# Altium project IMX425LLJ_MEZ.PrjPcb
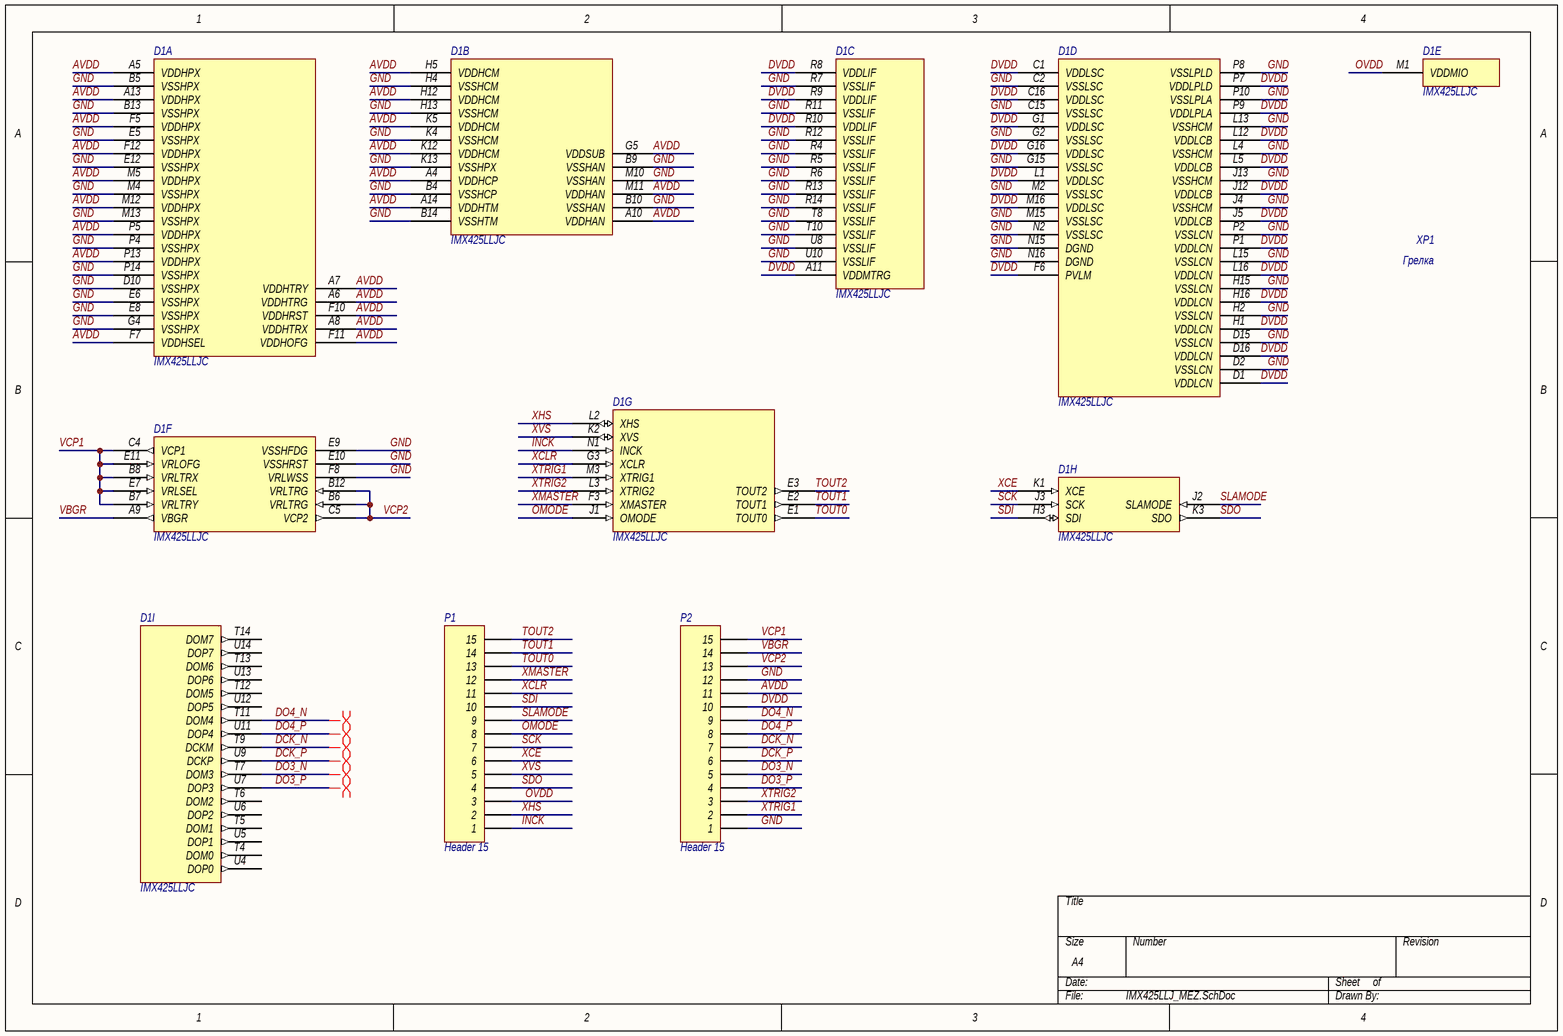
[diagram p0: IMX425LLJ_MEZ.SchDoc]
1 sheet, 4 parts. Net scope: global (net labels, ports and power ports of the same name join across sheets).
Board file: IMX425LLJ_MEZ.PcbDoc

## Sheet IMX425LLJ_MEZ.SchDoc
size A4; SheetNumber: 1; SheetTotal: 1

### Parts
D1  IMX425LLJC  [IMX425LLJC]  (parts A,B,C,D,E,F,G,H,I of 9)
P1  Header 15  [HDR1X15]
P2  Header 15  [HDR1X15]
XP1  Грелка  [Грелка]

### Nets
AVDD: D1.A4(VDDHCP) D1.A5(VDDHPX) D1.A6(VDDHTRG) D1.A7(VDDHTRY) D1.A8(VDDHTRX) D1.A10(VDDHAN) D1.A13(VDDHPX) D1.A14(VDDHTM) D1.F5(VDDHPX) D1.F7(VDDHSEL) D1.F10(VDDHRST) D1.F11(VDDHOFG) D1.F12(VDDHPX) D1.G5(VDDSUB) D1.H5(VDDHCM) D1.H12(VDDHCM) D1.K5(VDDHCM) D1.K12(VDDHCM) D1.M5(VDDHPX) D1.M11(VDDHAN) D1.M12(VDDHPX) D1.P5(VDDHPX) D1.P13(VDDHPX) P2.11
DCK_N: D1.T9(DCKM) P2.7
DCK_P: D1.U9(DCKP) P2.6
DO3_N: D1.T7(DOM3) P2.5
DO3_P: D1.U7(DOP3) P2.4
DO4_N: D1.T11(DOM4) P2.9
DO4_P: D1.U11(DOP4) P2.8
DVDD: D1.A11(VDDMTRG) D1.C1(VDDLSC) D1.C16(VDDLSC) D1.D1(VDDLCN) D1.D16(VDDLCN) D1.F6(PVLM) D1.G1(VDDLSC) D1.G16(VDDLSC) D1.H1(VDDLCN) D1.H16(VDDLCN) D1.J5(VDDLCB) D1.J12(VDDLCB) D1.L1(VDDLSC) D1.L5(VDDLCB) D1.L12(VDDLCB) D1.L16(VDDLCN) D1.M16(VDDLSC) D1.P1(VDDLCN) D1.P7(VDDLPLD) D1.P9(VDDLPLA) D1.R8(VDDLIF) D1.R9(VDDLIF) D1.R10(VDDLIF) P2.10
GND: D1.B4(VSSHCP) D1.B5(VSSHPX) D1.B9(VSSHAN) D1.B10(VSSHAN) D1.B13(VSSHPX) D1.B14(VSSHTM) D1.C2(VSSLSC) D1.C15(VSSLSC) D1.D2(VSSLCN) D1.D10(VSSHPX) D1.D15(VSSLCN) D1.E5(VSSHPX) D1.E6(VSSHPX) D1.E8(VSSHPX) D1.E9(VSSHFDG) D1.E10(VSSHRST) D1.E12(VSSHPX) D1.F8(VRLWSS) D1.G2(VSSLSC) D1.G4(VSSHPX) D1.G15(VSSLSC) D1.H2(VSSLCN) D1.H4(VSSHCM) D1.H13(VSSHCM) D1.H15(VSSLCN) D1.J4(VSSHCM) D1.J13(VSSHCM) D1.K4(VSSHCM) D1.K13(VSSHPX) D1.L4(VSSHCM) D1.L13(VSSHCM) D1.L15(VSSLCN) D1.M2(VSSLSC) D1.M4(VSSHPX) D1.M10(VSSHAN) D1.M13(VSSHPX) D1.M15(VSSLSC) D1.N2(VSSLSC) D1.N15(DGND) D1.N16(DGND) D1.P2(VSSLCN) D1.P4(VSSHPX) D1.P8(VSSLPLD) D1.P10(VSSLPLA) D1.P14(VSSHPX) D1.R4(VSSLIF) D1.R5(VSSLIF) D1.R6(VSSLIF) D1.R7(VSSLIF) D1.R11(VSSLIF) D1.R12(VSSLIF) D1.R13(VSSLIF) D1.R14(VSSLIF) D1.T8(VSSLIF) D1.T10(VSSLIF) D1.U8(VSSLIF) D1.U10(VSSLIF) P2.1 P2.12
INCK: D1.N1(INCK) P1.1
OMODE: D1.J1(OMODE) P1.8
OVDD: D1.M1(VDDMIO) P1.3
SCK: D1.J3(SCK) P1.7
SDI: D1.H3(SDI) P1.10
SDO: D1.K3(SDO) P1.4
SLAMODE: D1.J2(SLAMODE) P1.9
TOUT0: D1.E1(TOUT0) P1.13
TOUT1: D1.E2(TOUT1) P1.14
TOUT2: D1.E3(TOUT2) P1.15
VBGR: D1.A9(VBGR) P2.14
VCP1: D1.B7(VRLTRY) D1.B8(VRLTRX) D1.C4(VCP1) D1.E7(VRLSEL) D1.E11(VRLOFG) P2.15
VCP2: D1.B6(VRLTRG) D1.B12(VRLTRG) D1.C5(VCP2) P2.13
XCE: D1.K1(XCE) P1.6
XCLR: D1.G3(XCLR) P1.11
XHS: D1.L2(XHS) P1.2
XMASTER: D1.F3(XMASTER) P1.12
XTRIG1: D1.M3(XTRIG1) P2.2
XTRIG2: D1.L3(XTRIG2) P2.3
XVS: D1.K2(XVS) P1.5

Not connected (* = marked no-connect by the designer): D1 T4(DOM0) T5(DOM1) T6(DOM2) T12(DOM5) T13(DOM6) T14(DOM7) U4(DOP0) U5(DOP1) U6(DOP2) U12(DOP5) U13(DOP6) U14(DOP7)

### Layout directives
differential pair: DCK_N, DCK_P, DO3_N, DO3_P, DO4_N, DO4_P

### Library data of the parts
P1 P2 = Header 15: Header, 15-Pin; LatestRevisionDate: 17-Jul-2002; LatestRevisionNote: Re-released for DXP Platform.; Publisher: Altium Limited